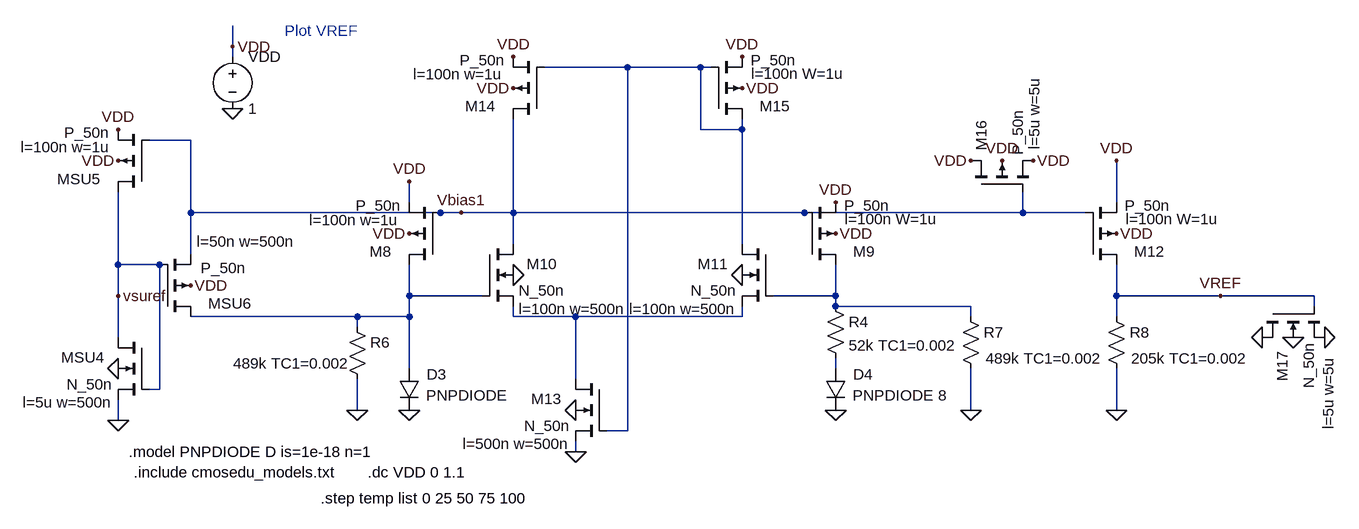
[diagram p0: schematic Fig23_31.asc]
Fig23_31.asc, the LTspice schematic file:
Version 4
SHEET 1 3272 680
WIRE 1568 -1536 1568 -1568
WIRE 1568 -1520 1568 -1536
WIRE 2176 -1504 2048 -1504
WIRE 2288 -1504 2176 -1504
WIRE 2304 -1504 2288 -1504
WIRE 2288 -1408 2288 -1504
WIRE 2352 -1408 2352 -1424
WIRE 2352 -1408 2288 -1408
WIRE 1504 -1392 1440 -1392
WIRE 2928 -1296 2928 -1360
WIRE 1840 -1296 1840 -1328
WIRE 1504 -1280 1504 -1392
WIRE 1888 -1280 1504 -1280
WIRE 1920 -1280 1888 -1280
WIRE 2000 -1280 2000 -1424
WIRE 2000 -1280 1920 -1280
WIRE 2448 -1280 2000 -1280
WIRE 2784 -1280 2784 -1312
WIRE 2784 -1280 2448 -1280
WIRE 2880 -1280 2784 -1280
WIRE 2000 -1232 2000 -1280
WIRE 2352 -1232 2352 -1408
WIRE 1504 -1216 1504 -1280
WIRE 1392 -1200 1392 -1312
WIRE 1456 -1200 1392 -1200
WIRE 1392 -1152 1392 -1200
WIRE 1840 -1152 1840 -1200
WIRE 1952 -1152 1840 -1152
WIRE 2496 -1152 2496 -1200
WIRE 2496 -1152 2400 -1152
WIRE 2928 -1152 2928 -1200
WIRE 3088 -1152 2928 -1152
WIRE 3232 -1152 3088 -1152
WIRE 2496 -1136 2496 -1152
WIRE 2704 -1136 2496 -1136
WIRE 3232 -1136 3232 -1152
WIRE 1760 -1120 1504 -1120
WIRE 1840 -1120 1840 -1152
WIRE 1840 -1120 1760 -1120
WIRE 2000 -1120 2000 -1136
WIRE 2096 -1120 2000 -1120
WIRE 2352 -1120 2352 -1136
WIRE 2352 -1120 2096 -1120
WIRE 2704 -1120 2704 -1136
WIRE 2928 -1120 2928 -1152
WIRE 1760 -1104 1760 -1120
WIRE 1392 -1088 1392 -1152
WIRE 1840 -1040 1840 -1120
WIRE 2496 -1040 2496 -1056
WIRE 2096 -1024 2096 -1120
WIRE 1456 -1008 1456 -1200
WIRE 1456 -1008 1440 -1008
WIRE 1760 -976 1760 -1024
WIRE 2704 -976 2704 -1040
WIRE 2928 -976 2928 -1040
WIRE 1392 -960 1392 -992
WIRE 2176 -944 2176 -1504
WIRE 2176 -944 2144 -944
WIRE 2096 -912 2096 -928
FLAG 1568 -1440 0
FLAG 1568 -1536 VDD
FLAG 1392 -1040 0
FLAG 1392 -960 0
FLAG 1392 -1360 VDD
FLAG 1392 -1408 VDD
FLAG 1840 -1248 VDD
FLAG 1840 -1328 VDD
FLAG 2496 -1248 VDD
FLAG 2496 -1296 VDD
FLAG 2000 -1184 0
FLAG 2352 -1184 0
FLAG 1840 -976 0
FLAG 1504 -1168 VDD
FLAG 1392 -1152 vsuref
FLAG 1920 -1280 Vbias1
FLAG 2496 -976 0
FLAG 1760 -976 0
FLAG 2704 -976 0
FLAG 2928 -1248 VDD
FLAG 2928 -1360 VDD
FLAG 2928 -976 0
FLAG 3088 -1152 VREF
FLAG 2096 -976 0
FLAG 2000 -1472 VDD
FLAG 2000 -1520 VDD
FLAG 2352 -1472 VDD
FLAG 2352 -1520 VDD
FLAG 2096 -912 0
FLAG 2752 -1360 VDD
FLAG 2704 -1360 VDD
FLAG 2800 -1360 VDD
FLAG 3200 -1088 0
FLAG 3152 -1088 0
FLAG 3248 -1088 0
SYMBOL voltage 1568 -1536 R0
WINDOW 123 0 0 Left 2
WINDOW 39 0 0 Left 2
SYMATTR InstName VDD
SYMATTR Value 1
SYMBOL nmos4 1440 -1088 M0
WINDOW 123 56 100 Left 2
WINDOW 0 69 31 Left 2
SYMATTR Value2 l=5u w=500n
SYMATTR InstName MSU4
SYMATTR Value N_50n
SYMBOL pmos4 1440 -1312 R180
WINDOW 0 75 20 Left 2
WINDOW 3 61 91 Left 2
WINDOW 123 59 69 Left 2
SYMATTR InstName MSU5
SYMATTR Value P_50n
SYMATTR Value2 l=100n w=1u
SYMBOL pmos4 1888 -1200 R180
WINDOW 0 75 20 Left 2
WINDOW 3 61 91 Left 2
WINDOW 123 63 69 Left 2
SYMATTR InstName M8
SYMATTR Value P_50n
SYMATTR Value2 l=100n w=1u
SYMBOL pmos4 2448 -1200 M180
WINDOW 0 75 20 Left 2
WINDOW 3 61 91 Left 2
WINDOW 123 62 70 Left 2
SYMATTR InstName M9
SYMATTR Value P_50n
SYMATTR Value2 l=100n W=1u
SYMBOL nmos4 1952 -1232 R0
WINDOW 123 56 100 Left 2
WINDOW 0 69 31 Left 2
SYMATTR Value2 l=100n w=500n
SYMATTR InstName M10
SYMATTR Value N_50n
SYMBOL nmos4 2400 -1232 M0
WINDOW 123 56 100 Left 2
WINDOW 0 69 31 Left 2
SYMATTR Value2 l=100n w=500n
SYMATTR InstName M11
SYMATTR Value N_50n
SYMBOL res 2480 -1152 R0
SYMATTR InstName R4
SYMATTR Value 52k TC1=0.002
SYMBOL diode 1824 -1040 R0
WINDOW 0 43 9 Left 2
WINDOW 3 42 41 Left 2
SYMATTR InstName D3
SYMATTR Value PNPDIODE
SYMBOL pmos4 1456 -1120 M180
WINDOW 0 75 20 Left 2
WINDOW 3 63 75 Left 2
WINDOW 123 57 116 Left 2
SYMATTR InstName MSU6
SYMATTR Value P_50n
SYMATTR Value2 l=50n w=500n
SYMBOL diode 2480 -1040 R0
WINDOW 0 43 9 Left 2
WINDOW 3 42 41 Left 2
SYMATTR InstName D4
SYMATTR Value PNPDIODE 8
SYMBOL res 1744 -1120 R0
WINDOW 3 -175 72 Left 2
SYMATTR Value 489k TC1=0.002
SYMATTR InstName R6
SYMBOL res 2688 -1136 R0
WINDOW 3 39 80 Left 2
SYMATTR Value 489k TC1=0.002
SYMATTR InstName R7
SYMBOL pmos4 2880 -1200 M180
WINDOW 0 75 20 Left 2
WINDOW 3 61 91 Left 2
WINDOW 123 62 70 Left 2
SYMATTR InstName M12
SYMATTR Value P_50n
SYMATTR Value2 l=100n W=1u
SYMBOL res 2912 -1136 R0
WINDOW 3 39 80 Left 2
SYMATTR Value 205k TC1=0.002
SYMATTR InstName R8
SYMBOL nmos4 2144 -1024 M0
WINDOW 123 56 100 Left 2
WINDOW 0 69 31 Left 2
SYMATTR Value2 l=500n w=500n
SYMATTR InstName M13
SYMATTR Value N_50n
SYMBOL pmos4 2048 -1424 R180
WINDOW 0 75 20 Left 2
WINDOW 3 61 91 Left 2
WINDOW 123 63 69 Left 2
SYMATTR InstName M14
SYMATTR Value P_50n
SYMATTR Value2 l=100n w=1u
SYMBOL pmos4 2304 -1424 M180
WINDOW 0 75 20 Left 2
WINDOW 3 61 91 Left 2
WINDOW 123 62 70 Left 2
SYMATTR InstName M15
SYMATTR Value P_50n
SYMATTR Value2 l=100n W=1u
SYMBOL pmos4 2704 -1312 R270
WINDOW 0 63 16 Left 2
WINDOW 123 65 98 Left 2
SYMATTR InstName M16
SYMATTR Value2 l=5u w=5u
SYMATTR Value P_50n
SYMBOL nmos4 3152 -1136 M90
WINDOW 123 78 102 Left 2
WINDOW 0 69 31 Left 2
SYMATTR Value2 l=5u w=5u
SYMATTR InstName M17
SYMATTR Value N_50n
TEXT 1648 -1560 Left 2 ;Plot VREF
TEXT 1776 -880 Left 2 !.dc VDD 0 1.1
TEXT 1416 -880 Left 2 !.include cmosedu_models.txt
TEXT 1704 -840 Left 2 !.step temp list 0 25 50 75 100
TEXT 1408 -912 Left 2 !.model PNPDIODE D is=1e-18 n=1

The netlist it stands for:
* Fig23_31.asc
VDD VDD 0 1
MSU4 vsuref vsuref 0 0 N_50n l=5u w=500n
MSU5 vsuref Vbias1 VDD VDD P_50n l=100n w=1u
M8 N002 Vbias1 VDD VDD P_50n l=100n w=1u
M9 N003 Vbias1 VDD VDD P_50n l=100n W=1u
M10 Vbias1 N002 N004 0 N_50n l=100n w=500n
M11 N001 N003 N004 0 N_50n l=100n w=500n
R4 N003 N005 52k TC1=0.002
D3 N002 0 PNPDIODE
MSU6 N002 vsuref Vbias1 VDD P_50n l=50n w=500n
D4 N005 0 PNPDIODE 8
R6 N002 0 489k TC1=0.002
R7 N003 0 489k TC1=0.002
M12 VREF Vbias1 VDD VDD P_50n l=100n W=1u
R8 VREF 0 205k TC1=0.002
M13 N004 N001 0 0 N_50n l=500n w=500n
M14 Vbias1 N001 VDD VDD P_50n l=100n w=1u
M15 N001 N001 VDD VDD P_50n l=100n W=1u
M16 VDD Vbias1 VDD VDD P_50n l=5u w=5u
M17 0 VREF 0 0 N_50n l=5u w=5u
.model D D
.lib standard.dio
.model NMOS NMOS
.model PMOS PMOS
.lib standard.mos
* Plot VREF
.dc VDD 0 1.1
.include cmosedu_models.txt
.step temp list 0 25 50 75 100
.model PNPDIODE D is=1e-18 n=1
.backanno
.end